# EAGLE design Sensor Board (EAGLE 6.5.0)
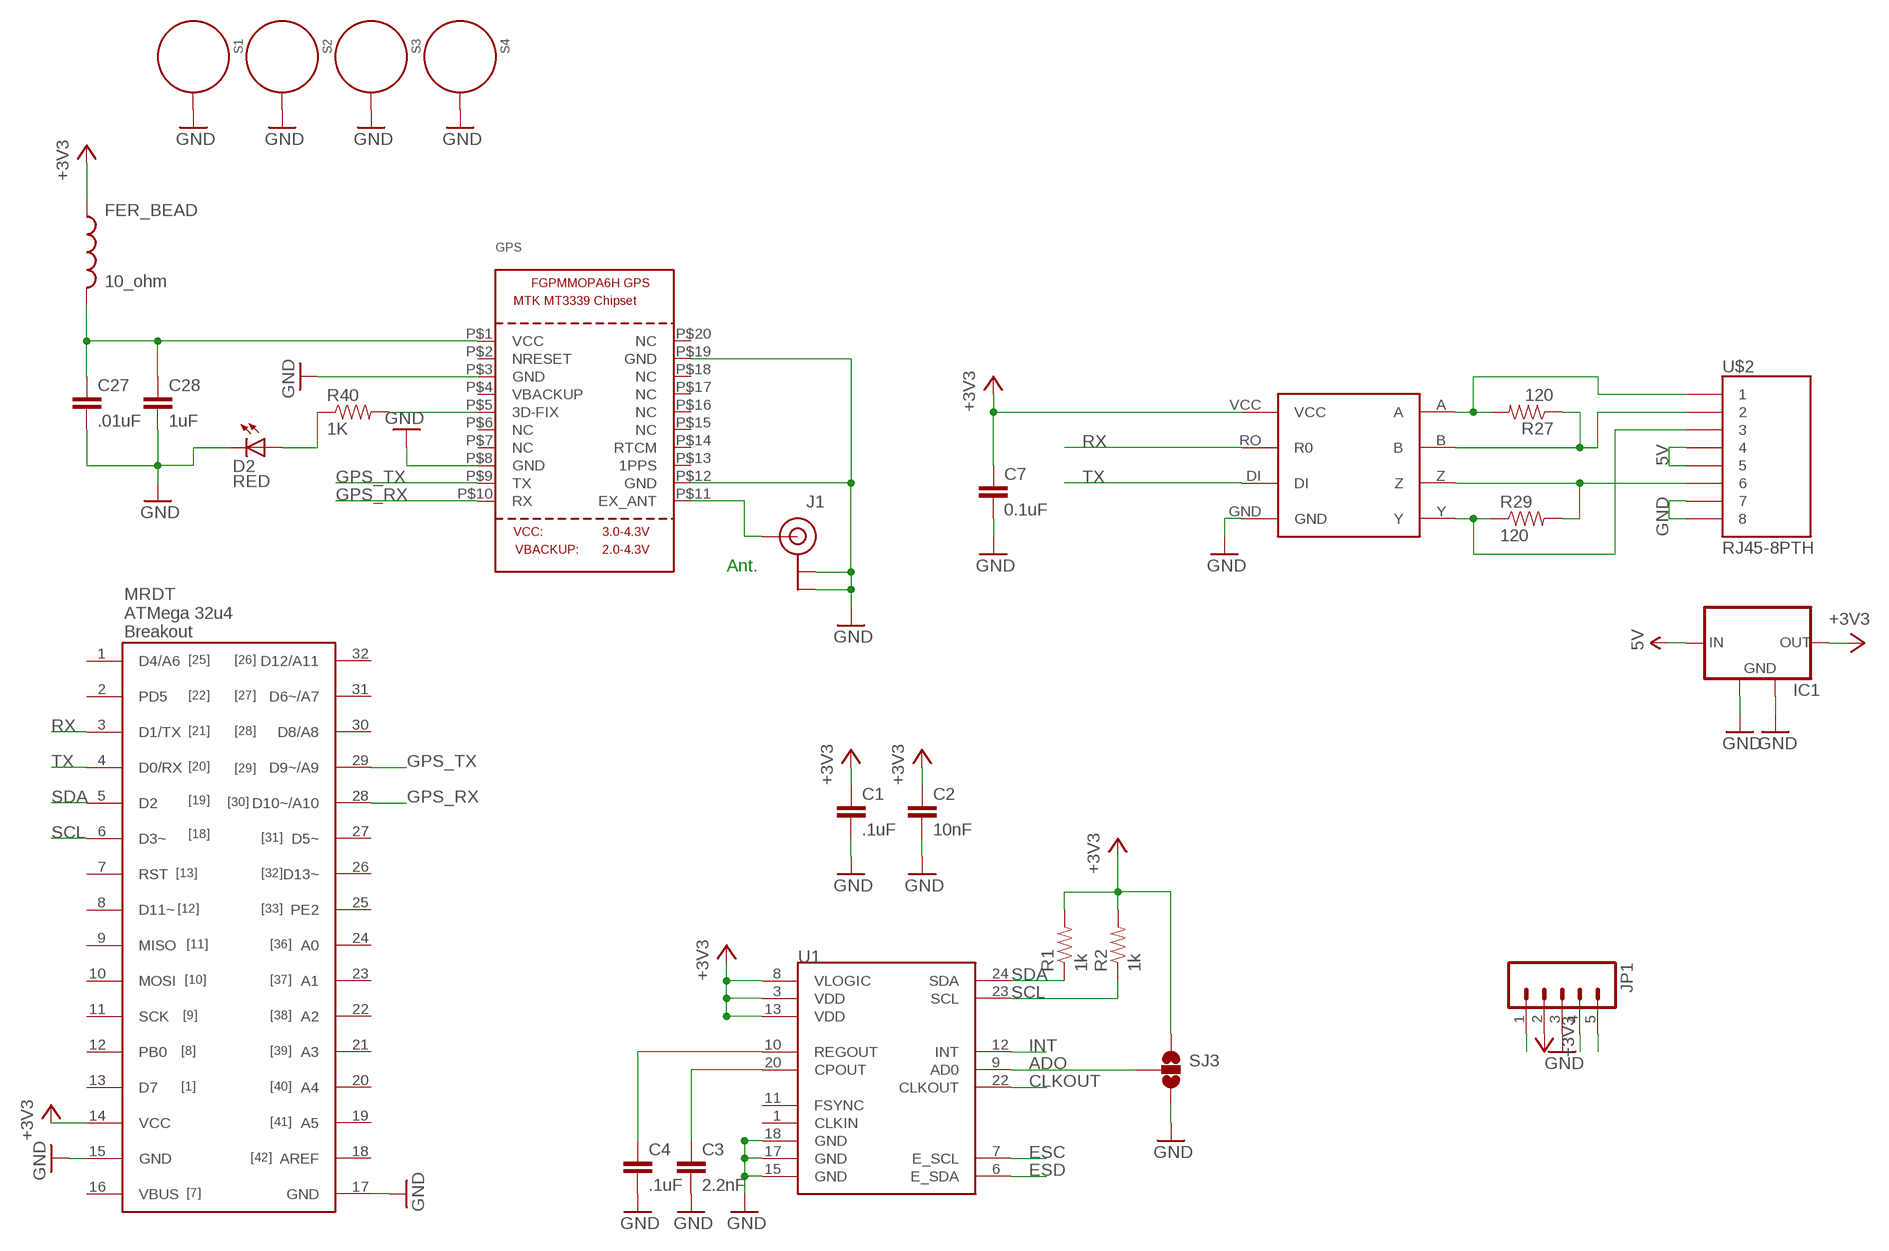
[diagram p0: schematic, sheet 1]

## Parts
C1  .1uF  CAP1206  [1206]
C2  10nF  CAP1206  [1206]
C3  2.2nF  CAP1206  [1206]
C4  .1uF  CAP1206  [1206]
C7  0.1uF  CAP1206  [1206]
C27  .01uF  CAP1206  [1206]
C28  1uF  CAP1206  [1206]
D2  RED  LED-RED1206  [LED-1206]
FER_BEAD  10_ohm  INDUCTOR30OHM,1.8A  [0603]
GPS  GPS_FGPMMOPA6H  [FGPMMOPA6H]
IC1  MCP1825S-SOT223  [SOT223]
J1  U.FL  [U.FL]
JP1  M05PTH  [1X05]
R1  1k  RESISTOR1206  [1206]
R2  1k  RESISTOR1206  [1206]
R27  120  RESISTOR1206  [1206]
R29  120  RESISTOR1206  [1206]
R40  1K  RESISTOR1206  [1206]
RS-485-2  MAX3077  [MAX3070E]
S1  STANDOFF_ELECTRICAL  [STANDOFF-ELECTRICAL]
S2  STANDOFF_ELECTRICAL  [STANDOFF-ELECTRICAL]
S3  STANDOFF_ELECTRICAL  [STANDOFF-ELECTRICAL]
S4  STANDOFF_ELECTRICAL  [STANDOFF-ELECTRICAL]
SJ3  SOLDERJUMPER_2WAYS  [SJ_3]
U1  MPU-9150QFN-24-NP  [QFN-24-NP]
U$1  32U4_BREAKOUT  [32U4_MCU_DIP]
U$2  RJ45-8PTH  [RJ45-8]

## Nets
5V: IC1.1(IN) U$2.4 U$2.5
18_RX+: R27.2 RS-485-2.A U$2.1
18_RX-: R27.1 RS-485-2.B U$2.2
18_TX+: R29.1 RS-485-2.Y U$2.3
18_TX-: R29.2 RS-485-2.Z U$2.6
+3V3: C1.1 C2.1 C7.1 FER_BEAD.1 IC1.3(OUT) JP1.2 R1.2 R2.2 RS-485-2.VCC SJ3.1 U1.3(VDD) U1.8(VLOGIC) U1.13(VDD) U$1.14(VCC)
ADO: SJ3.2 U1.9(AD0)
CLKOUT: U1.22(CLKOUT)
CPOUT: C3.1 U1.20(CPOUT)
ESC: U1.7(E_SCL)
ESD: U1.6(E_SDA)
GND: C1.2 C2.2 C3.2 C4.2 C7.2 C27.2 C28.2 D2.C GPS.P$3(GND) GPS.P$8(GND) GPS.P$12(GND) GPS.P$19(GND) IC1.2(GND) IC1.4(GND) J1.P$1(GND) J1.P$2(GND) JP1.3 RS-485-2.GND S1.P1 S2.P1 S3.P1 S4.P1 SJ3.3 U1.15(GND) U1.17(GND) U1.18(GND) U$1.15(GND) U$1.17(GND) U$2.7 U$2.8
GPS_RX: GPS.P$10(RX) U$1.28(D10~/A10)
GPS_TX: GPS.P$9(TX) U$1.29(D9~/A9)
INT: U1.12(INT)
IO: JP1.1
N$1: D2.A R40.1
N$2: GPS.P$5(3D-FIX) R40.2
N$5: GPS.P$11(EX_ANT) J1.P$3(SIGNAL)
N$47: C27.1 C28.1 FER_BEAD.2 GPS.P$1(VCC)
REGOUT: C4.1 U1.10(REGOUT)
RX: RS-485-2.RO(R0) U$1.3(D1/TX)
SCL: JP1.4 R2.1 U1.23(SCL) U$1.6(D3~)
SDA: JP1.5 R1.1 U1.24(SDA) U$1.5(D2)
TX: RS-485-2.DI U$1.4(D0/RX)
Unconnected: GPS.P$2(NRESET) GPS.P$4(VBACKUP) GPS.P$6(NC) GPS.P$7(NC) GPS.P$13(1PPS) GPS.P$14(RTCM) GPS.P$15(NC) GPS.P$16(NC) GPS.P$17(NC) GPS.P$18(NC) GPS.P$20(NC) U1.1(CLKIN) U1.11(FSYNC) U$1.1(D4/A6) U$1.2(PD5) U$1.7(RST) U$1.8(D11~) U$1.9(MISO) U$1.10(MOSI) U$1.11(SCK) U$1.12(PB0) U$1.13(D7) U$1.16(VBUS) U$1.18(AREF) U$1.19(A5) U$1.20(A4) U$1.21(A3) U$1.22(A2) U$1.23(A1) U$1.24(A0) U$1.25(PE2) U$1.26(D13~) U$1.27(D5~) U$1.30(D8/A8) U$1.31(D6~/A7) U$1.32(D12/A11)

## Notes on the sheet
- Ant.

## Library data of the parts
C1-C4 = SparkFun-Capacitors:CAP: Capacitor Standard 0603 ceramic capacitor, and 0.1" leaded capacitor.
C7 C27 C28 = SparkFun-Passives:CAP: Capacitor Standard 0603 ceramic capacitor, and 0.1" leaded capacitor.
D2 = SparkFun-LED:LED-RED: Assorted Red LEDs LilyPad 1206- DIO-09912 1206- DIO-00809 0603- DIO-00819; PROD_ID: DIO-00809
FER_BEAD = SparkFun-Passives:INDUCTOR: Inductors Basic Inductor/Choke - 0603 and 1206. Footprints are not proven and vary greatly between part numbers. SRN6045- 33uH, 20% 1.4A SDR0403-560KL - 56uH, 10%, 500mA RMS/740mA peak
GPS = adafruit:GPS_FGPMMOPA6H: GPS Module - MTK MT3339 Chipset, -165dBm sensitivity, 22 channels, 10Hz, auto-select external antenna options
IC1 = Spark:MCP1825S: 500 mA, Low Voltage, Low Quiescent Current LDO Regulator
J1 = SparkFun-Connectors:U.FL: SMD antenna connector- WRL-09144
JP1 = SparkFun-Connectors:M05: Header 5 Standard 5-pin 0.1" header. Use with straight break away headers (SKU : PRT-00116), right angle break away headers (PRT-00553), swiss pins (PRT-00743), machine pins (PRT-00117), and female headers (PRT-00115). Molex polarized connector foot print use with SKU : PRT-08230 with associated crimp pins and housings.
R1 R2 = SparkFun-Resistors:RESISTOR: Resistor Basic schematic elements and footprints for 0603, 1206, and PTH resistors.
R27 R29 R40 = SparkFun-Passives:RESISTOR: Resistor Basic schematic elements and footprints for 0603, 1206, and PTH resistors.
RS-485-2 = MAX3077:MAX3077
S1-S4 = SparkFun-Electromechanical:STANDOFF_ELECTRICAL: A standoff intended to be an electrically connected point. Pad size and stop size allow for a #4 Phillips pan screw head to make a solid connection to the board.
SJ3 = SparkFun-Retired:SOLDERJUMPER_2WAY: Solder Jumper 2 way solder jumper
U1 = MRDT-2015-General:MPU-9150: 9DOF (3mag, 3accel, 3rotat). I2C interface.
U$1 = MRDT-2015-General:32U4_BREAKOUT
U$2 = SparkFun-Connectors:RJ45-8: RJ45 Jack Simple RJ45, 8-pin connection - connector for common Cat5, Cat5e, and Cat6 Ethernet cables. Footprint not yet proven in production. Connector sku is PRT-00643; Breakout PCB sku is BOB-00716.

## Board
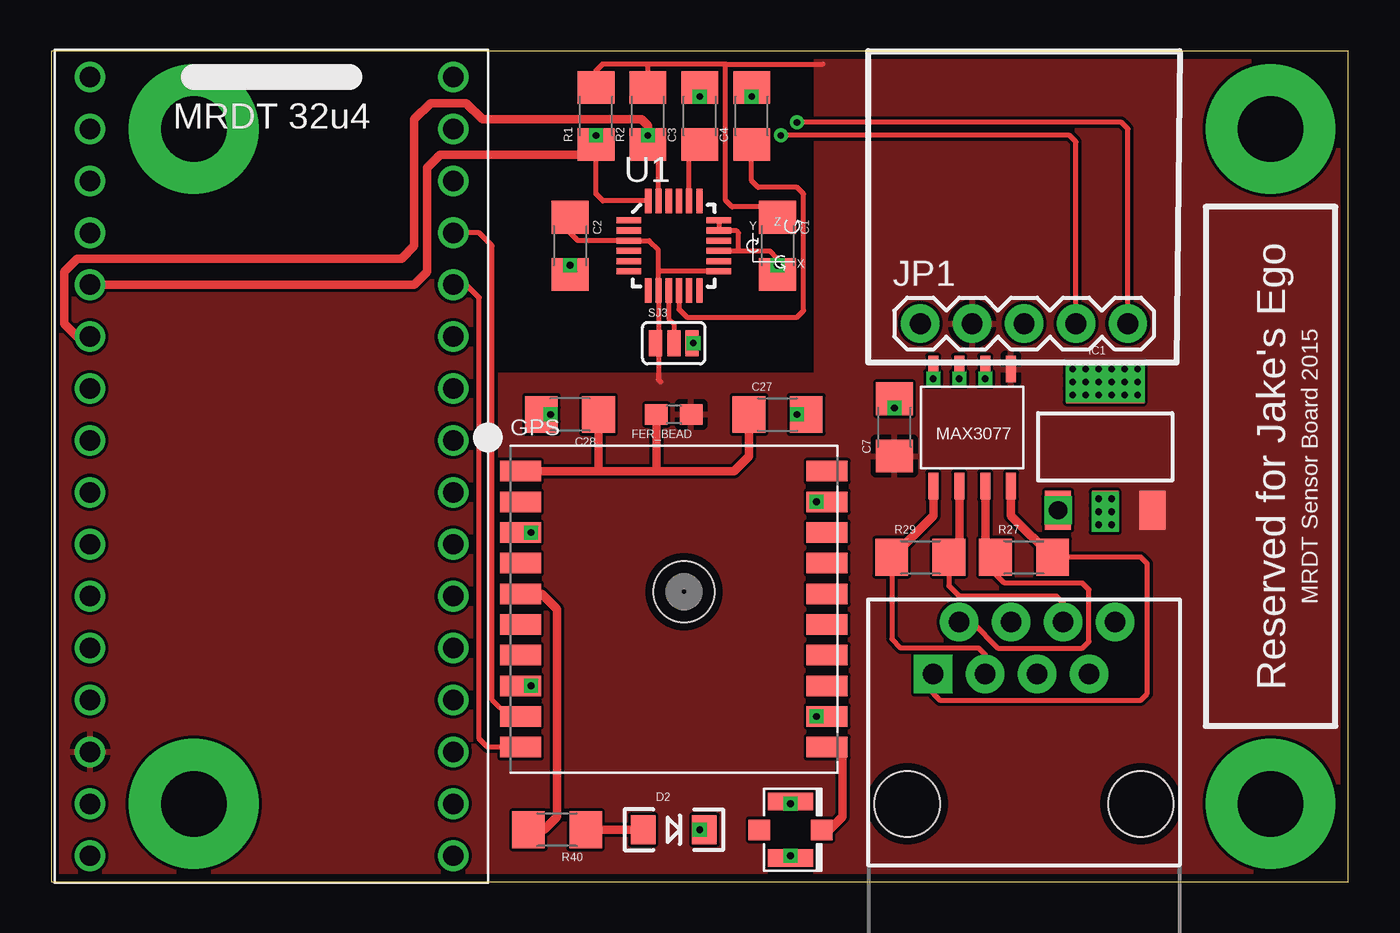
[diagram p1: board, top side]
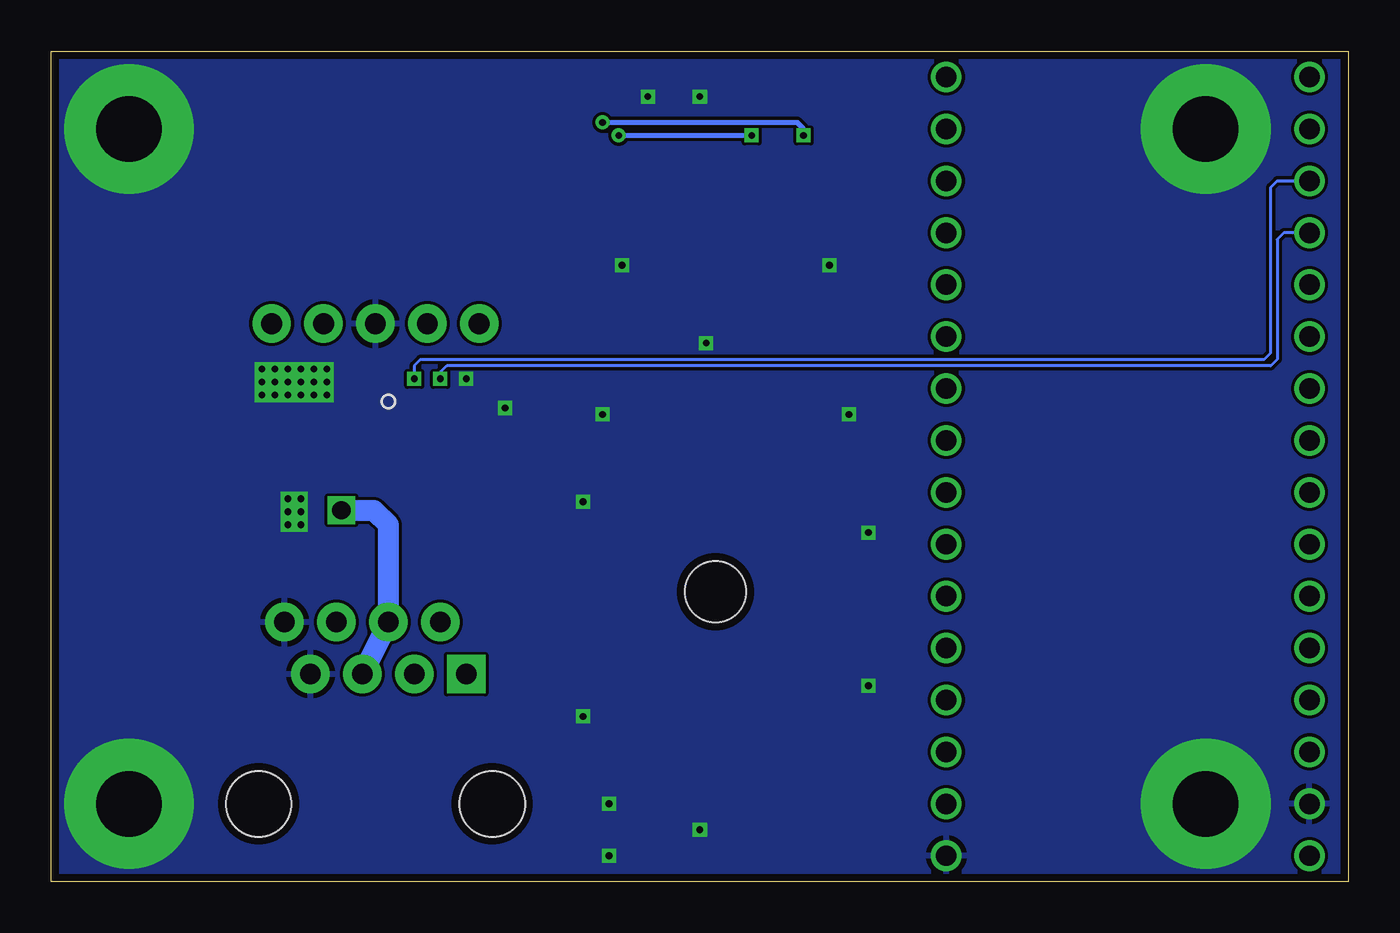
[diagram p2: board, bottom side, seen from below]

Size 63.5 x 40.64 mm. Coordinates in mm from the lower left corner, seen from the top.
Outline: 0,0 63.5,0 63.5,40.64 0,40.64 0,0
Copper layers (1*16): Top 0.0356mm / dielectric 1.5011mm / Bottom 0.0356mm
Design rules "LaenPCBOrder": minimum track width 6mil, minimum drill 13mil, track to track 6mil, track to pad 6mil, pad to pad 6mil, via to via 6mil, smd to smd 6mil, copper to edge 15mil, drill to drill 6mil, minimum pad ring 7mil, minimum via ring 7mil, stop-mask expansion 3mil, vias tented up to drill 0mil, thermal gap 10mil

### Footprints (pad centres in the part's own frame; a part is rotated, then mirrored left to right if it is on the bottom)
1206 = smd 1.6 x 1.8: 1 -1.4,0; 2 1.4,0
LED-1206 = smd 1.2 x 1.4: A -1.5,0; C 1.5,0
0603 = smd 1.1 x 1: 1 -0.85,0; 2 0.85,0
FGPMMOPA6H = smd 2 x 1: P$1 -7.5,6.75; P$2 -7.5,5.25; P$3 -7.5,3.75; P$4 -7.5,2.25; P$5 -7.5,0.75; P$6 -7.5,-0.75; P$7 -7.5,-2.25; P$8 -7.5,-3.75; P$9 -7.5,-5.25; P$10 -7.5,-6.75; P$11 7.5,-6.75; P$12 7.5,-5.25; P$13 7.5,-3.75; P$14 7.5,-2.25; P$15 7.5,-0.75; P$16 7.5,0.75; P$17 7.5,2.25; P$18 7.5,3.75; P$19 7.5,5.25; P$20 7.5,6.75 | hole 3: 0.5,0.85
SOT223 = smd 1.27 x 1.905: 1 -2.311,-3.099; 2 0,-3.099; 3 2.311,-3.099 | smd 3.81 x 1.905: 4 0,3.099
U.FL = smd 2.2 x 0.85: P$1 0,1.375; P$2 0,-1.375 | smd 1.05 x 1: P$3 1.525,0; P$4 -1.525,0
1X05 = drill 1.016 pad 1.88: 1 0,0; 2 2.54,0; 3 5.08,0; 4 7.62,0; 5 10.16,0
MAX3070E = smd 0.49 x 1.3: A -1.905,2.857; B -0.635,2.857; DI 0.635,-2.857; GND 1.905,-2.857; RO -0.635,-2.857; VCC -1.905,-2.857; Y 1.905,2.857; Z 0.635,2.857
STANDOFF-ELECTRICAL = drill 3.2 pad 6.35: P1 0,0
SJ_3 = smd 0.635 x 1.27: 1 -0.889,0; 2 0,0; 3 0.889,0
QFN-24-NP = smd 1.2 x 0.3: 1 -2.2,1.25; 2 -2.2,0.75; 3 -2.2,0.25; 4 -2.2,-0.25; 5 -2.2,-0.75; 6 -2.2,-1.25; 13 2.2,-1.25; 14 2.2,-0.75; 15 2.2,-0.25; 16 2.2,0.25; 17 2.2,0.75; 18 2.2,1.25 | smd 0.3 x 1.2: 7 -1.25,-2.2; 8 -0.75,-2.2; 9 -0.25,-2.2; 10 0.25,-2.2; 11 0.75,-2.2; 12 1.25,-2.2; 19 1.25,2.2; 20 0.75,2.2; 21 0.25,2.2; 22 -0.25,2.2; 23 -0.75,2.2; 24 -1.25,2.2
32U4_MCU_DIP = drill 1: 1 -8.89,19.05; 2 -8.89,16.51; 3 -8.89,13.97; 4 -8.89,11.43; 5 -8.89,8.89; 6 -8.89,6.35; 7 -8.89,3.81; 8 -8.89,1.27; 9 -8.89,-1.27; 10 -8.89,-3.81; 11 -8.89,-6.35; 12 -8.89,-8.89; 13 -8.89,-11.43; 14 -8.89,-13.97; 15 -8.89,-16.51; 16 -8.89,-19.05; 17 8.89,-19.05; 18 8.89,-16.51; 19 8.89,-13.97; 20 8.89,-11.43; 21 8.89,-8.89; 22 8.89,-6.35; 23 8.89,-3.81; 24 8.89,-1.27; 25 8.89,1.27; 26 8.89,3.81; 27 8.89,6.35; 28 8.89,8.89; 29 8.89,11.43; 30 8.89,13.97; 31 8.89,16.51; 32 8.89,19.05
RJ45-8 = drill 1 pad 1.88 square: 1 -4.445,6.35 | drill 1 pad 1.88: 2 -3.175,8.89; 3 -1.905,6.35; 4 -0.635,8.89; 5 0.635,6.35; 6 1.905,8.89; 7 3.175,6.35; 8 4.445,8.89 | hole 3.2: -5.715,0; 5.715,0

### Placement (x,y rotation side)
C1  35.56,31.11 270 top
C2  25.4,31.11 270 top
C3  31.75,37.47 90 top
C4  34.29,37.47 90 top
C7  41.27,22.23 90 top
C27  35.56,22.86 0 top
C28  25.4,22.86 180 top
D2  30.48,2.54 0 top
FER_BEAD  30.48,22.86 180 top
GPS  30.48,13.34 0 top
IC1  51.59,21.27 0 top
J1  36.2,2.54 0 top
JP1  42.55,27.3 0 top
R1  26.67,37.47 90 top
R2  29.21,37.47 90 top
R27  47.62,15.88 0 top
R29  42.55,15.88 0 top
R40  24.77,2.54 180 top
RS-485-2  45.09,22.23 180 top
S1  6.99,3.81 0 top
S2  59.69,36.83 0 top
S3  6.99,36.83 0 top
S4  59.69,3.81 0 top
SJ3  30.48,26.35 0 top
U1  30.48,31.11 0 top
U$1  10.79,20.32 0 top
U$2  47.62,3.81 0 top

### Tracks (layer width: path | path; a pad name or v marks a point on that pad's centre or on a via)
5V  (via drill 0.9)
  Top 1.016: 49.21,18.1 IC1.1
  Bottom 1.016: U$2.5 U$2.4 46.99,17.46 47.7,18.17 IC1.1
  other vias: 49.28,18.17
18_RX+
  Top 0.254: U$2.1 43.18,9.21 43.5,8.89 53.34,8.89 53.66,9.21 53.66,15.56 53.34,15.88 R27.2
  Top 0.406: RS-485-2.A 46.99,17.91 R27.2
18_RX-
  Top 0.254: U$2.2 45.09,12.7 46.35,11.43 50.48,11.43 50.8,11.75 50.8,14.29 50.48,14.61 46.67,14.61 46.23,15.05 R27.1
  Top 0.406: RS-485-2.B 45.72,16.38 R27.1
18_TX+
  Top 0.254: U$2.3 45.72,11.11 45.4,11.43 41.59,11.43 41.15,11.88 R29.1
  Top 0.406: RS-485-2.Y 43.18,17.91 R29.1
18_TX-
  Top 0.254: 43.95,15.43 R29.2 43.95,14.47 44.45,13.97 49.21,13.97 49.53,13.65 U$2.6
  Top 0.406: RS-485-2.Z 44.45,16.38 R29.2
+3V3
  Top 0.254: 29.73,29.84 U1.8 29.73,26.49 | 29.73,29.84 29.73,30.91 29.28,31.36 U1.3 25.79,31.36 25.4,31.75 C2.1 | U1.13 29.75,29.86 29.73,29.84 | C1.1 35.43,32.52 34.92,33.02 33.34,33.02 33.02,33.34 33.02,40.01 | 33.02,40.01 37.78,40.01 | 33.02,40.01 29.21,40.01 | 29.21,40.01 26.99,40.01 26.67,39.69 R1.2 | R2.2 29.21,40.01 | 29.73,26.49 29.73,24.56 29.84,24.45 | 29.73,26.49 SJ3.1
  pour Top: -0.64,41.27 -0.64,-0.64 64.14,-0.64 64.14,41.27 37.47,41.27 37.47,24.77 20.95,24.77 20.95,41.27
  pour Top (no thermals): 54.93,19.68 52.86,19.68 52.86,16.83 54.93,16.83
ADO
  Top 0.254: U1.9 30.23,27.55 30.48,27.3 SJ3.2
CPOUT
  Top 0.254: U1.20 31.23,35.55 C3.1
GND  (via drill 0.33)
  Top 0.254: v25.4,30.16 C2.2 | C1.2 v35.56,30.16 35.56,30.48 35.17,30.86 33.66,30.86 | SJ3.3 v31.43,26.35 | C3.2 v31.75,38.42 | C4.2 v34.29,38.42 | U1.18 U1.17 33.54,31.86 33.66,31.75 33.66,30.86 | U1.15 33.66,30.86 | C7.2 v41.27,23.18 | v43.18,24.61 RS-485-2.GND | IC1.2 51.35,18.17 v51.28,18.1 | IC1.4 51.84,24.37 v51.91,24.45
  Top 0.406: C28.2 v24.45,22.86 | J1.P$2 v36.2,1.27 | v36.2,3.81 J1.P$1 | v31.75,2.54 D2.C | C27.2 v36.51,22.86 | v23.5,17.09 GPS.P$3 | v23.5,9.59 GPS.P$8 | v37.47,8.09 GPS.P$12 | GPS.P$19 v37.47,18.59
  other vias: 50.01,23.81 50.01,24.45 50.01,25.08 50.64,25.08 51.28,25.08 51.91,25.08 52.55,25.08 53.18,25.08 53.18,24.45 53.18,23.81 52.55,23.81 52.55,24.45 51.91,23.81 51.28,23.81 50.64,23.81 50.64,24.45 51.28,24.45 51.28,17.46 51.28,18.73 51.91,18.73 51.91,18.1 51.91,17.46
  pour Bottom (isolate 0.152): -1.27,41.91 -1.27,-1.27 64.77,-1.27 64.77,41.91
  pour Bottom (no thermals): 55.24,40.64 55.24,32.38 63.5,32.38 63.5,40.64
  pour Bottom (no thermals): 55.24,8.26 55.24,0 63.5,0 63.5,8.26
  pour Bottom (no thermals): 3.17,7.62 3.17,0 10.79,0 10.79,7.62
  pour Bottom (no thermals): 3.17,40.64 3.17,33.02 10.79,33.02 10.79,40.64
GPS_RX
  Top 0.254: U$1.28 20.32,29.21 20.95,28.57 20.95,6.99 21.36,6.58 GPS.P$10
GPS_TX
  Top 0.254: GPS.P$9 22.39,8.09 21.59,8.89 21.59,31.11 20.95,31.75 U$1.29
N$1
  Top 0.406: R40.1 D2.A
N$2
  Top 0.406: GPS.P$5 24.02,14.09 24.77,13.34 24.77,3.17 24.13,2.54 R40.2
N$5
  Top 0.406: J1.P$3 38.1,2.54 38.73,3.17 38.73,6.35 38.22,6.35 GPS.P$11
N$47
  Top 0.406: GPS.P$1 26.8,20.09 | 26.8,20.09 29.63,20.09 | 29.63,20.09 33.42,20.09 34.16,20.82 C27.1 | FER_BEAD.2 29.63,20.09 | C28.1 26.8,20.09
REGOUT
  Top 0.254: U1.10 30.73,28.01 31.11,27.62 36.51,27.62 36.83,27.94 36.83,33.66 36.51,33.97 34.61,33.97 34.29,34.29 C4.1
RX  (via drill 0.33)
  Top 0.203: RS-485-2.RO v45.72,24.61
  Bottom 0.152: U$1.3 3.49,34.29 3.81,33.97 3.81,25.88 4.13,25.56 45.4,25.56 45.72,25.24 v45.72,24.61
SCL  (via drill 0.33)
  Top 0.254: U1.23 29.73,35.55 R2.1 | JP1.4 50.16,36.2 49.85,36.51 v35.72,36.51
  Top 0.406: U$1.6 1.27,26.67 0.64,27.3 0.64,29.84 1.27,30.48 17.14,30.48 17.78,31.11 17.78,37.31 18.57,38.1 20.32,38.1 21.11,37.31 28.89,37.31 29.21,36.99 v29.21,36.51 R2.1
  Bottom 0.254: v35.72,36.51 v29.21,36.51
SDA  (via drill 0.33)
  Top 0.254: U1.24 27.01,33.31 26.67,33.66 26.67,35.56 R1.1 | JP1.5 52.7,36.83 52.39,37.15 v36.51,37.15
  Top 0.305: v26.67,36.51 R1.1
  Top 0.406: 26.16,35.56 R1.1 | U$1.5 17.78,29.21 18.41,29.84 18.41,34.92 19.05,35.56 26.67,35.56
  Bottom 0.254: v26.67,36.51 26.67,36.83 26.99,37.15 v36.51,37.15
TX  (via drill 0.33)
  Top 0.152: RS-485-2.DI v44.45,24.61
  Bottom 0.152: U$1.4 3.17,31.75 3.49,31.43 3.49,25.56 3.81,25.24 44.13,25.24 44.45,24.92 v44.45,24.61

### Text on the board
tNames: Reserved for Jake's Ego | MRDT Sensor Board 2015